# EAGLE design BSK2 (EAGLE 9.4.2)
ESKD_DESCRIPTION1: 207|235|224|242|224|32|193|209|202|50; ESKD_DESCRIPTION2: 241|245|229|236|224|32|253|235|229|234|242|240|232|247|229|241|234|224|255; ESKD_DESCRIPTION3: 239|240|232|237|246|232|239|232|224|235|252|237|224|255; ESKD_NUMBER: 67|67|83|49|46|50|51|48|48|45|48|221|51; ESKD_NUMBER_SHEET: 49; ESKD_SHEETS: 49
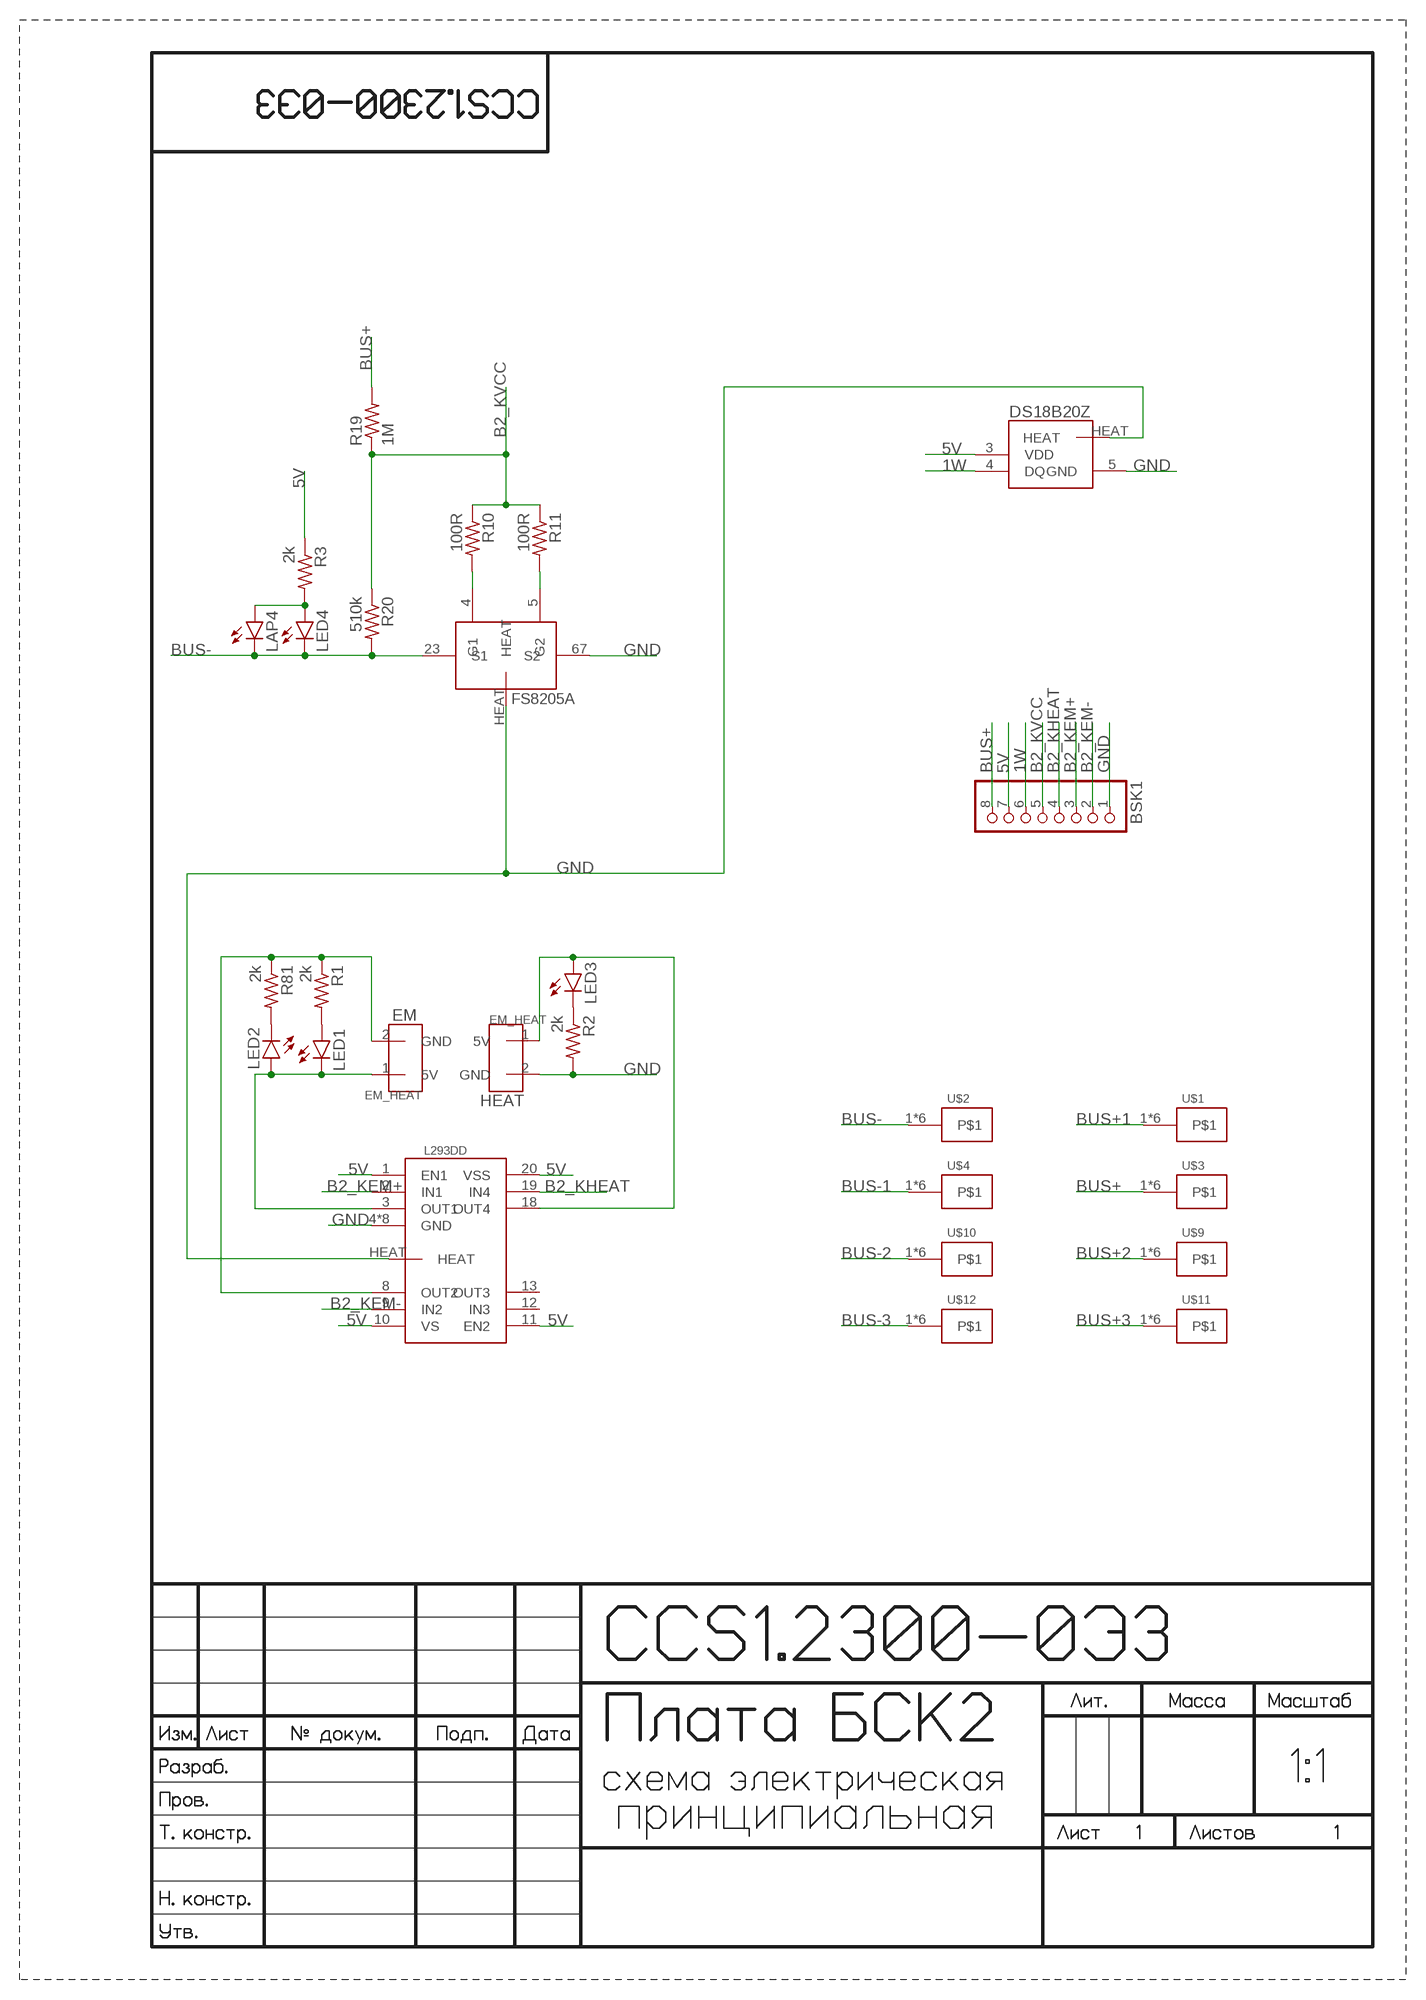
[diagram p0: schematic, sheet 1]

## Parts
BSK1  PINHD-1X8  [1X08]
DS18B20Z  DS18B20Z  [DS18B20Z]
FS8205A  FS8205A+  [FS8205A+]
L293DD  L293DD  [L293DD]
LAP4  LAP4-BOTTOM  [P47F-BOTTOM]
LED1  LEDCHIPLED_0603  [CHIPLED_0603]
LED2  LEDCHIPLED_0603  [CHIPLED_0603]
LED3  LEDCHIPLED_0603  [CHIPLED_0603]
LED4  LEDCHIPLED_0603  [CHIPLED_0603]
R1  2k  R-US_R0603  [R0603]
R2  2k  R-US_R0603  [R0603]
R3  2k  R-US_R0603  [R0603]
R10  100R  R-US_R0603  [R0603]
R11  100R  R-US_R0603  [R0603]
R19  1M  R-US_R0603  [R0603]
R20  510k  R-US_R0603  [R0603]
R81  2k  R-US_R0603  [R0603]
U$1  KCONNECT  [KCONNECT]
U$2  KCONNECT  [KCONNECT]
U$3  KCONNECT  [KCONNECT]
U$4  KCONNECT  [KCONNECT]
U$6  EM_HEAT  [EM_HEAT]
U$7  EM_HEAT  [EM_HEAT]
U$9  KCONNECT  [KCONNECT]
U$10  KCONNECT  [KCONNECT]
U$11  KCONNECT  [KCONNECT]
U$12  KCONNECT  [KCONNECT]

## Nets
1W: BSK1.6 DS18B20Z.4(DQ)
5V: BSK1.7 DS18B20Z.3(VDD) L293DD.1(EN1) L293DD.10(VS) L293DD.11(EN2) L293DD.20(VSS) R3.1
B2_KEM+: BSK1.3 L293DD.2(IN1)
B2_KEM-: BSK1.2 L293DD.9(IN2)
B2_KHEAT: BSK1.4 L293DD.19(IN4)
B2_KVCC: BSK1.5 R10.1 R11.1 R19.1 R20.1
BUS+: BSK1.8 R19.2 U$3.1 U$3.2 U$3.3 U$3.4 U$3.P$1 U$3.P$2
BUS+1: U$1.1 U$1.2 U$1.3 U$1.4 U$1.P$1 U$1.P$2
BUS+2: U$9.1 U$9.2 U$9.3 U$9.4 U$9.P$1 U$9.P$2
BUS+3: U$11.1 U$11.2 U$11.3 U$11.4 U$11.P$1 U$11.P$2
BUS-: FS8205A.23(S1) LAP4.C LED4.C R20.2 U$2.1 U$2.2 U$2.3 U$2.4 U$2.P$1 U$2.P$2
BUS-1: U$4.1 U$4.2 U$4.3 U$4.4 U$4.P$1 U$4.P$2
BUS-2: U$10.1 U$10.2 U$10.3 U$10.4 U$10.P$1 U$10.P$2
BUS-3: U$12.1 U$12.2 U$12.3 U$12.4 U$12.P$1 U$12.P$2
GND: BSK1.1 DS18B20Z.5(GND) DS18B20Z.HEAT FS8205A.67(S2) FS8205A.HEAT L293DD.4(GND) L293DD.5(GND) L293DD.6(GND) L293DD.7(GND) L293DD.14(GND) L293DD.15(GND) L293DD.16(GND) L293DD.17(GND) L293DD.HEAT R2.2 U$7.2(GND)
N$1: L293DD.3(OUT1) LED1.C LED2.A U$6.1(5V)
N$2: L293DD.8(OUT2) R1.1 R81.1 U$6.2(GND)
N$3: L293DD.18(OUT4) LED3.A U$7.1(5V)
N$8: FS8205A.4(G1) R10.2
N$9: FS8205A.5(G2) R11.2
N$22: LED2.C R81.2
N$23: LED1.A R1.2
N$24: LED3.C R2.1
N$25: LAP4.A LED4.A R3.2
Unconnected: L293DD.12(IN3) L293DD.13(OUT3)

## Notes on the sheet
- EM
- HEAT

## Library data of the parts
BSK1 = pinheadCS:PINHD-1X8: PIN HEADER
DS18B20Z = CanCubeSat:DS18B20Z
FS8205A = CanCubeSat:FS8205A+
L293DD = CanCubeSat:L293DD
LAP4 = led:*P4: PointLED® Enhanced Thinfilm LED TOP & BOTTOM mount LS P47F, LR P47F, LA P47F, LY P47F, LT P4SG, LB P4SG, LW P4SG Source: http://catalog.osram-os.com .. LA_LR_LS_LY_P47F_Pb_free.pdf
LED1-LED4 = led:LED: LED OSRAM: - CHIPLED LG R971, LG N971, LY N971, LG Q971, LY Q971, LO R971, LY R971 LH N974, LH R974 LS Q976, LO Q976, LY Q976 LO Q996 - Hyper CHIPLED LW Q18S LB Q993, LB Q99A, LB R99A - SideLED LS A670, LO A670, LY A670, LG A670, LP A670 LB A673, LV A673, LT A673, LW A673 LH A674 LY A675 LS A676, LA A676, LO A676, LY A676, LW A676 LS A679, LY A679, LG A679 - Hyper Micro SIDELED® LS Y876, LA Y876, LO Y876, LY Y876 LT Y87S - SmartLED LW L88C, LW L88S LB L89C, LB L89S, LG L890 LS L89K, LO L89K, LY L89K LS L896, LA L896, LO L896, LY L896 - TOPLED LS T670, LO T670, LY T670, LG T670, LP T670 LSG T670, LSP T670, LSY T670, LOP T670, LYG T670 LG T671, LOG T671, LSG T671 LB T673, LV T673, LT T673, LW T673 LH T674 LS T676, LA T676, LO T676, LY T676, LB T676, LH T676, LSB T676, LW T676 LB T67C, LV T67C, LT T67C, LS T67K, LO T67K, LY T67K, LW E67C LS E67B, LA E67B, LO E67B, LY E67B, LB E67C, LV E67C, LT E67C LW T67C LS T679, LY T679, LG T679 LS T770, LO T770, LY T770, LG T770, LP T770 LB T773, LV T773, LT T773, LW T773 LH T774 LS E675, LA E675, LY E675, LS T675 LS T776, LA T776, LO T776, LY T776, LB T776 LHGB T686 LT T68C, LB T68C - Hyper Mini TOPLED® LB M676 - Mini TOPLED Santana® LG M470 LS M47K, LO M47K, LY M47K Source: http://www.osram.convergy.de LUXEON: - LUMILED® LXK2-PW12-R00, LXK2-PW12-S00, LXK2-PW14-U00, LXK2-PW14-V00 LXK2-PM12-R00, LXK2-PM12-S00, LXK2-PM14-U00 LXK2-PE12-Q00, LXK2-PE12-R00, LXK2-PE12-S00, LXK2-PE14-T00, LXK2-PE14-U00 LXK2-PB12-K00, LXK2-PB12-L00, LXK2-PB12-M00, LXK2-PB14-N00, LXK2-PB14-P00, LXK2-PB14-Q00 LXK2-PR12-L00, LXK2-PR12-M00, LXK2-PR14-Q00, LXK2-PR14-R00 LXK2-PD12-Q00, LXK2-PD12-R00, LXK2-PD12-S00 LXK2-PH12-R00, LXK2-PH12-S00 LXK2-PL12-P00, LXK2-PL12-Q00, LXK2-PL12-R00 Source: www.luxeon.com KINGBRIGHT: KA-3528ASYC Source: www.kingbright.com
R1-R3 R10 R11 R19 R20 R81 = resistor:R-US_: RESISTOR, American symbol
U$1-U$4 U$9-U$12 = CanCubeSat:KCONNECT
U$6 U$7 = CanCubeSat:EM_HEAT

## Board
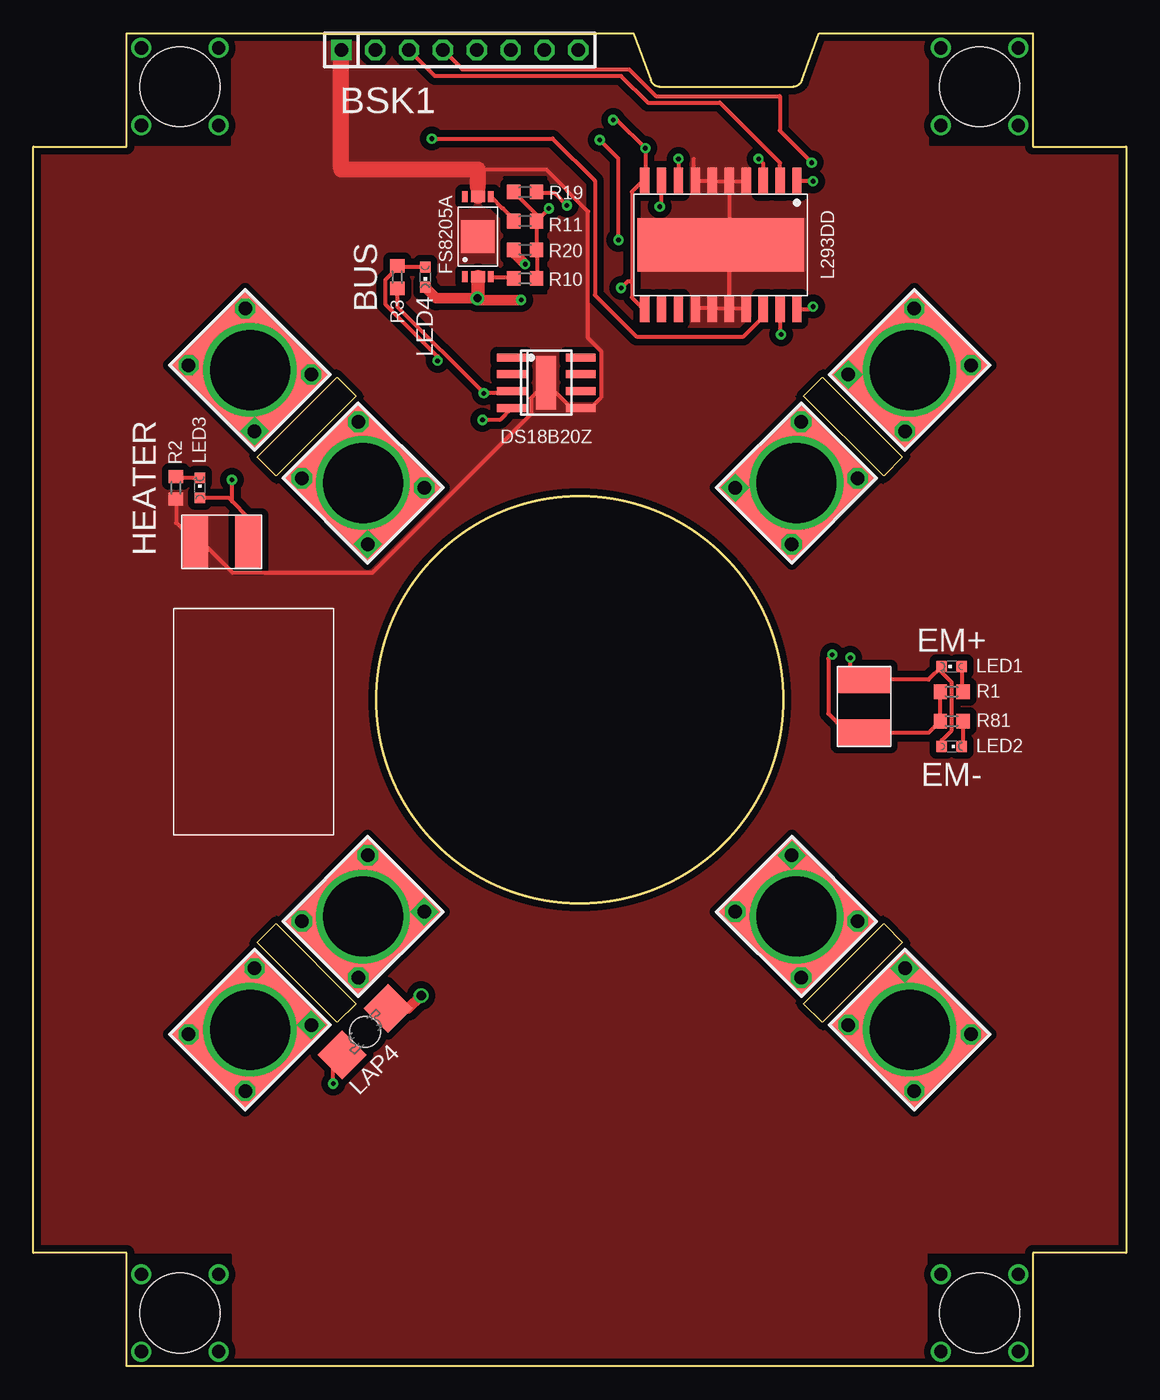
[diagram p1: board, top side]
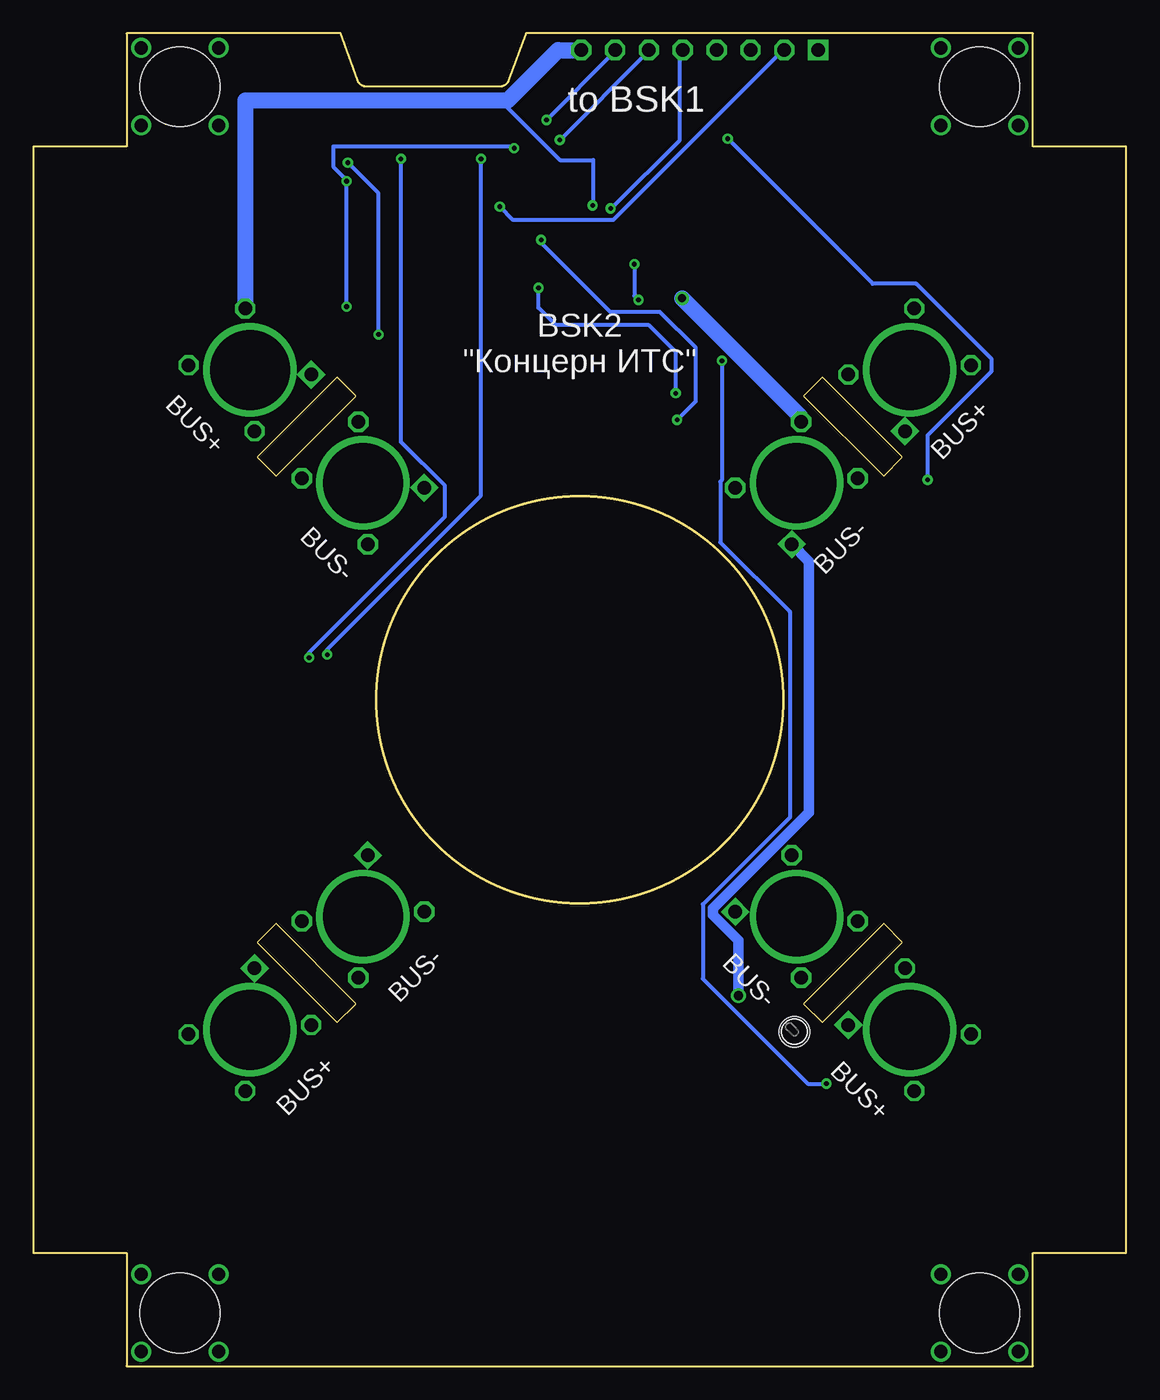
[diagram p2: board, bottom side, seen from below]

Size 82 x 100 mm. Coordinates in mm from the lower left corner, seen from the top.
Outline: 0,8.5 0,91.5 7,91.5 7,100 45.04,100 46.33,96.47 arc70 47,96 57,96 arc70 57.67,96.47 58.96,100 75,100 75,91.5 82,91.5 82,8.5 75,8.5 75,0 7,0 7,8.5 0,8.5
Outline: 57.79,27.2 63.8,33.21 65.22,31.79 59.21,25.78 57.79,27.2
Outline: 16.78,68.21 22.79,74.22 24.21,72.8 18.2,66.79 16.78,68.21
Outline: 63.8,66.79 57.79,72.8 59.21,74.22 65.22,68.21 63.8,66.79
Outline: 22.79,25.78 16.78,31.79 18.2,33.21 24.21,27.2 22.79,25.78
Outline: circle at 41,50 radius 15.25
Copper layers (1*16): Top 0.035mm / dielectric 1.5mm / Bottom 0.035mm
Design rules "default *": minimum track width 0.3mm, minimum drill 0.35mm, track to track 0.2mm, track to pad 0.2mm, pad to pad 0.2mm, via to via 0.2mm, smd to smd 0.2mm, copper to edge 0.25mm, drill to drill 6mil, minimum pad ring 10mil, minimum via ring 8mil, stop-mask expansion 2mil, vias tented up to drill 0mil, thermal gap 10mil
Holes 6 mm at 11,4 71,4 71,96 11,96

### Footprints (pad centres in the part's own frame; a part is rotated, then mirrored left to right if it is on the bottom)
1X08 = drill 1.016 square: 1 -8.89,0 | drill 1.016 octagon: 2 -6.35,0; 3 -3.81,0; 4 -1.27,0; 5 1.27,0; 6 3.81,0; 7 6.35,0; 8 8.89,0
DS18B20Z = smd 0.6 x 2.2: 1 -1.905,-2.6; 2 -0.635,-2.6; 3 0.635,-2.6; 4 1.905,-2.6; 5 1.905,2.6; 6 0.635,2.6; 7 -0.635,2.6; 8 -1.905,2.6 | smd 4 x 1.5: HEAT 0,0
FS8205A+ = smd 0.4 x 0.8: 1 -0.975,-3; 4 0.975,-3; 5 0.975,3; 8 -0.975,3 | smd 1.05 x 0.8: 23 0,-3; 67 0,3 | smd 2.5 x 2.5: HEAT 0,0
L293DD = smd 0.7 x 2: 1 -5.715,-4.8; 2 -4.445,-4.8; 3 -3.175,-4.8; 4 -1.905,-4.8; 5 -0.635,-4.8; 6 0.635,-4.8; 7 1.905,-4.8; 8 3.175,-4.8; 9 4.445,-4.8; 10 5.715,-4.8; 11 5.715,4.8; 12 4.445,4.8; 13 3.175,4.8; 14 1.905,4.8; 15 0.635,4.8; 16 -0.635,4.8; 17 -1.905,4.8; 18 -3.175,4.8; 19 -4.445,4.8; 20 -5.715,4.8 | smd 12.5 x 4: HEAT 0,0
P47F-BOTTOM = smd 2.6 x 2.6: A -2.45,0; C 2.45,0 | hole 2.3: 0,0
CHIPLED_0603 = smd 0.8 x 0.8: A 0,-0.75; C 0,0.75
R0603 = smd 1 x 1.1: 1 -0.85,0; 2 0.85,0
KCONNECT = drill 1.016 square: 1 -3,-3.5 | drill 1.016 octagon: 2 -3,3.5; 3 3,-3.5; 4 3,3.5 | drill 6: P$1 0,0 | smd 8 x 9: P$2 0,0
EM_HEAT = smd 2 x 4: 1 -2,0; 2 2,0

### Placement (x,y rotation side)
BSK1  32,98.75 0 top
DS18B20Z  38.48,73.78 270 top
FS8205A  33.36,84.74 0 top
L293DD  51.58,84.12 180 top
LAP4  24.9,25.1 45 top
LED1  68.9,52.5 90 top
LED2  68.9,46.5 270 top
LED3  12.5,65.9 0 top
LED4  29.4,81.7 180 top
R1  68.9,50.6 0 top
R2  10.7,65.9 270 top
R3  27.3,81.7 90 top
R10  36.91,81.61 180 top
R11  36.91,85.91 180 top
R19  36.91,88.09 0 top
R20  36.91,83.76 180 top
R81  68.9,48.4 0 top
U$1  16.25,74.75 45 top
U$2  24.74,66.26 45 top
U$3  65.75,74.75 315 top
U$4  57.26,66.26 315 top
U$6  62.34,49.51 270 top
U$7  14.13,61.86 180 top
U$9  16.25,25.25 135 top
U$10  24.74,33.74 135 top
U$11  65.75,25.25 225 top
U$12  57.26,33.74 225 top

### Tracks (layer width: path | path; a pad name or v marks a point on that pad's centre or on a via)
1W  (via drill 0.35)
  Top 0.3: DS18B20Z.4 35.01,71 v33.7,71 | v43.9,84.5 43.9,90.6 v42.5,92
  Bottom 0.3: v33.7,71 32.3,72.4 32.3,76.4 35,79.1 38.7,79.1 43.9,84.3 v43.9,84.5 | v42.5,92 36,98.5 BSK1.6
5V  (via drill 0.35)
  Top 0.3: L293DD.1 57.45,88.9 v58.5,88.9 | 44.91,81.4 44.91,88.12 45.69,88.9 L293DD.10 45.92,89.12 v45.92,91.39 43.8,93.5 v43.5,93.5 | 44.91,81.4 44.91,80.17 45.69,79.4 L293DD.11 | L293DD.20 58.22,79.32 58.4,79.5 v58.5,79.5 | DS18B20Z.3 35.73,73 v33.8,73 27.3,79.5 R3.1 | v44.1,80.9 44.6,81.4 44.91,81.4
  Bottom 0.3: v58.5,79.5 v58.5,88.9 58.5,89 59.5,90 59.5,91.5 46,91.5 v45.92,91.39 | v33.8,73 33.8,76.1 35.8,78.1 42.8,78.1 44.1,79.4 v44.1,80.9 | v43.5,93.5 38.5,98.5 BSK1.7
B2_KEM+
  Top 0.3: L293DD.2 56.02,90.28 51.5,94.8 46.1,94.8 44.1,96.8 30.14,96.8 BSK1.3
B2_KEM-  (via drill 0.35)
  Top 0.3: v47,87 47.13,87.14 L293DD.9
  Bottom 0.3: v47,87 46,86 38.5,86 26,98.5 BSK1.2
B2_KHEAT  (via drill 0.35)
  Top 0.3: L293DD.19 56.02,77.47 v56.1,77.4 | BSK1.4 31,98.5 32.2,97.3 44.7,97.3 46.7,95.3 56,95.3 56,92.7 v58.4,90.3
  Bottom 0.3: v56.1,77.4 56.1,88 v58.4,90.3
B2_KVCC  (via drill 0.35)
  Top 0.3: R10.1 37.77,81.66 37.77,83.69 R20.1 37.77,83.92 37.77,85.73 R11.1 | v38.68,86.86 37.77,85.96 R11.1 | R19.1 37.76,86.39 R11.1
  Bottom 0.3: BSK1.5 33.5,98.5 33.5,92 38.5,87 v38.68,86.86
BUS+  (via drill 0.35)
  Top 0.3: v40.04,87.09 39.13,87.99 37.77,87.99 R19.2 | 65.6,74.42 65.6,74.65 U$3.P$2 | 65.6,74.42 65.6,70.35 U$3.3 | 65.6,74.42 61.3,74.42 U$3.1 | 65.6,74.42 U$3.P$2 | 66.05,75.1 70.12,75.1 U$3.4 | 66.05,75.1 65.82,74.87 U$3.P$2 | 66.05,75.1 66.05,79.17 U$3.2 | 66.05,75.1 U$3.P$2
  Bottom 0.3: v40.04,87.09 40,87 40,90.5 42.5,90.5 46.5,94.5 46.5,94.96
  Bottom 1.2: BSK1.8 42.63,98.75 46.42,94.96 46.5,94.96 66.1,94.96 U$3.2
BUS+1
  Top 0.3: 15.83,75.1 11.76,75.1 U$1.2 | 15.83,75.1 16.06,74.87 U$1.P$2 | 15.83,75.1 15.83,79.17 U$1.4 | 15.83,75.1 U$1.P$2 | 16.51,74.42 16.51,70.35 U$1.1 | 16.51,74.42 16.29,74.65 U$1.P$2 | 16.51,74.42 20.81,74.42 U$1.3 | 16.51,74.42 U$1.P$2
BUS+2
  Top 0.3: 16.06,24.88 16.06,25.11 U$9.P$2 | 16.06,24.88 16.06,20.81 U$9.2 | 16.06,24.88 11.76,24.88 U$9.4 | 16.06,24.88 U$9.P$2 | 16.51,25.79 16.51,25.56 16.29,25.33 U$9.P$2 | 16.51,25.79 16.51,29.63 U$9.3 | 16.51,25.79 20.81,25.79 U$9.1 | 16.51,25.79 U$9.P$2
BUS+3
  Top 0.3: 66.05,24.88 66.05,20.81 U$11.4 | 66.05,24.88 65.82,25.11 U$11.P$2 | 65.37,25.56 61.3,25.56 U$11.3 | 65.37,25.56 65.6,25.33 U$11.P$2 | 66.05,24.88 70.12,24.88 U$11.2 | 66.05,24.88 U$11.P$2 | 65.37,25.56 65.37,29.63 U$11.1 | 65.37,25.56 U$11.P$2
BUS-  (via drill 0.35, 0.6, 0.7)
  Top 0.3: 24.88,66.05 24.88,61.75 U$2.1 | 24.88,66.05 29.18,66.05 U$2.3 | 24.88,66.05 U$2.P$2 | 24.43,66.5 20.36,66.5 U$2.2 | 24.43,66.5 24.66,66.28 U$2.P$2 | 24.43,66.5 24.43,70.8 U$2.4 | 24.43,66.5 U$2.P$2
  Top 0.8: v33.32,80.12 30.23,80.12 LED4.C | v36.9,82.68 36.06,83.52 R20.2 | v36.6,80 33.52,80 33.36,80.16 | v29.1,27.8 28.13,26.83 LAP4.C
  Top 1: v33.32,80.12 33.36,80.16 FS8205A.23
  Bottom 0.3: v36.9,82.68 36.9,80.3 v36.6,80
  Bottom 0.8: U$2.1 23.8,60.37 23.8,41.56 31.01,34.34 31.01,33.84 29.1,31.93 v29.1,27.8
  Bottom 1.2: v33.32,80.12 24.5,71.3 U$2.4
BUS-1
  Top 0.3: 57,65.82 57,61.75 U$4.3 | 57,65.82 57.23,66.05 U$4.P$2 | 57,65.82 52.7,65.82 U$4.1 | 57,65.82 U$4.P$2 | 57.45,66.73 57.45,66.28 U$4.P$2 | 57.45,66.73 57.45,70.8 U$4.2 | 57.45,66.73 61.75,66.73 U$4.4 | 57.45,66.73 U$4.P$2
BUS-2
  Top 0.3: 24.43,33.48 24.43,29.18 U$10.2 | 24.43,33.48 24.66,33.7 U$10.P$2 | 24.43,33.48 20.36,33.48 U$10.4 | 24.43,33.48 U$10.P$2 | 24.88,34.16 24.88,33.93 U$10.P$2 | 24.88,34.16 24.88,38.23 U$10.3 | 24.88,34.16 29.18,34.16 U$10.1 | 24.88,34.16 U$10.P$2
BUS-3
  Top 0.3: 57.45,33.48 57.45,33.7 U$12.P$2 | 57.45,33.48 57.45,29.18 U$12.4 | 57.45,33.48 61.75,33.48 U$12.2 | 57.45,33.48 U$12.P$2 | 57,33.93 57.23,33.93 U$12.P$2 | 57,33.93 52.7,33.93 U$12.3 | 57,33.93 57,38.23 U$12.1 | 57,33.93 U$12.P$2
GND
  Top 0.3: 52.25,88.9 53.38,88.9 L293DD.4 | 52.25,88.9 L293DD.5 52.03,88.9 51.12,88.9 L293DD.6 50.9,88.9 49.76,88.9 L293DD.7 49.54,89.12 49.54,90.58 | L293DD.16 52.03,79.4 51.12,79.4 L293DD.15 50.9,79.4 49.76,79.4 L293DD.14 49.54,79.17 | L293DD.17 53.38,79.4 52.25,79.4 L293DD.16 | 52.25,88.9 52.25,84.79 L293DD.HEAT 52.22,83.48 L293DD.16 | R2.2 10.7,63.29 U$7.2 12.63,61.86 14.98,59.51 25.41,59.51 37.33,71.43 37.33,72.63 DS18B20Z.HEAT 40.38,71.88 DS18B20Z.5 41.17,71.93 41.85,71.93 42.63,72.71 42.63,76.13 41.62,77.13 41.62,86.64 38.45,89.8 33.36,89.8
  Top 1.1: FS8205A.67 33.36,88.5
  Top 1.2: 33.36,88.5 33.36,89.8 23.11,89.8 BSK1.1
  cutout Top: 16.25,68.25 18.25,66.25 24.75,72.75 22.75,74.75
  pour Top (isolate 0.5, no thermals): 0,91.5 14.9,91.5 14.9,100 45,100 45,99.5 45.4,99.1 45.4,98.4 45.7,98.1 45.7,97.5 46.1,97.1 46.1,96.6 46.7,96 57.3,96 57.9,96.6 57.9,97.1 58.2,97.4 58.2,97.9 58.5,98.2 58.5,98.7 58.8,99 58.8,99.5 59,99.7 59,100 67.1,100 67.1,91.5 82,91.5 82,8.5 67,8.5 67,0 15,0 15,8.4 14.9,8.5 0,8.5
  cutout Top: 35.3,89.2 35.3,80.5 38.5,80.5 38.5,89.2
HEAT1
  cutout Top: 57.25,27.25 59.25,25.25 65.75,31.75 63.75,33.75
HEAT2
  cutout Top: 63.75,66.25 65.75,68.25 59.25,74.75 57.25,72.75
HEAT3
  cutout Top: 22.75,25.25 24.75,27.25 18.25,33.75 16.25,31.75
N$1  (via drill 0.35)
  Top 0.3: v61.3,53.16 61.3,52.48 62.2,51.57 U$6.1 67.16,51.51 LED1.C 68.15,52.05 68.9,51.3 68.9,47.7 68.15,46.95 LED2.A | v54.41,90.58 54.76,90.24 L293DD.3
  Bottom 0.3: v54.41,90.58 54.41,69.34 51.12,66.05 51.12,63.74 61.3,53.56 v61.3,53.16
N$2  (via drill 0.35)
  Top 0.3: v48.41,90.58 48.41,89.12 L293DD.8 | v59.94,53.38 59.64,53.08 59.64,48.96 60.87,47.73 62.12,47.73 U$6.2 67.16,47.51 R81.1 R1.1
  Bottom 0.3: v48.41,90.58 48.41,65.32 59.94,53.78 v59.94,53.38
N$3  (via drill 0.35)
  Top 0.3: L293DD.18 54.74,79.17 54.74,78.72 53.28,77.26 45.24,77.26 42.13,80.37 42.13,88.94 38.97,92.1 v29.9,92.1 | 14.9,64.9 v14.9,66.5 | LED3.A 14.65,65.15 14.9,64.9 | U$7.1 16.13,63.67 14.9,64.9
  Bottom 0.3: v14.9,66.5 14.9,69.85 10.09,74.66 10.09,75.54 15.76,81.21 19.01,81.21 v29.9,92.1
N$4  (via drill 1)
  other vias: 8.1,6.9
N$5  (via drill 1)
  other vias: 8.1,1.1
N$6  (via drill 1)
  other vias: 13.9,1.1
N$7  (via drill 1)
  other vias: 13.9,6.9
N$8
  Top 0.3: FS8205A.4 34.38,81.66 35.97,81.66 R10.2
N$9
  Top 0.3: FS8205A.5 35.21,86.86 35.25,86.86 36.06,86.05 R11.2
N$10  (via drill 1)
  other vias: 68.1,6.9
N$11  (via drill 1)
  other vias: 68.1,1.1
N$12  (via drill 1)
  other vias: 73.9,1.1
N$13  (via drill 1)
  other vias: 73.9,6.9
N$14  (via drill 1)
  other vias: 68.1,98.9
N$15  (via drill 1)
  other vias: 68.1,93.1
N$16  (via drill 1)
  other vias: 73.9,93.1
N$17  (via drill 1)
  other vias: 73.9,98.9
N$18  (via drill 1)
  other vias: 8.1,98.9
N$19  (via drill 1)
  other vias: 8.1,93.1
N$20  (via drill 1)
  other vias: 13.9,93.1
N$21  (via drill 1)
  other vias: 13.9,98.9
N$22
  Top 0.3: R81.2 69.75,46.6 LED2.C
N$23
  Top 0.3: LED1.A 69.65,50.7 R1.2
N$24
  Top 0.3: R2.1 10.8,66.65 LED3.C
N$25  (via drill 0.35)
  Top 0.3: LED4.A 27.4,82.45 R3.2 27.3,82.39 26.4,81.5 26.4,79.69 30.34,75.76 v30.34,75.44 | v22.5,21.2 22.5,22.7 LAP4.A
  Bottom 0.3: v30.34,75.44 30.34,66.48 30.45,66.37 30.45,61.81 25.25,56.61 25.25,41.17 31.76,34.65 31.76,29.07 23.89,21.2 v22.5,21.2

### Text on the board
tPlace: BUS | HEATER | EM+ | EM-
bNames: to BSK1 | BSK2 / "Концерн ИТС" | BUS+ | BUS+ | BUS- | BUS- | BUS- | BUS- | BUS+ | BUS+